# EAGLE design 6in_alarm_4te-disp (EAGLE 5.07)
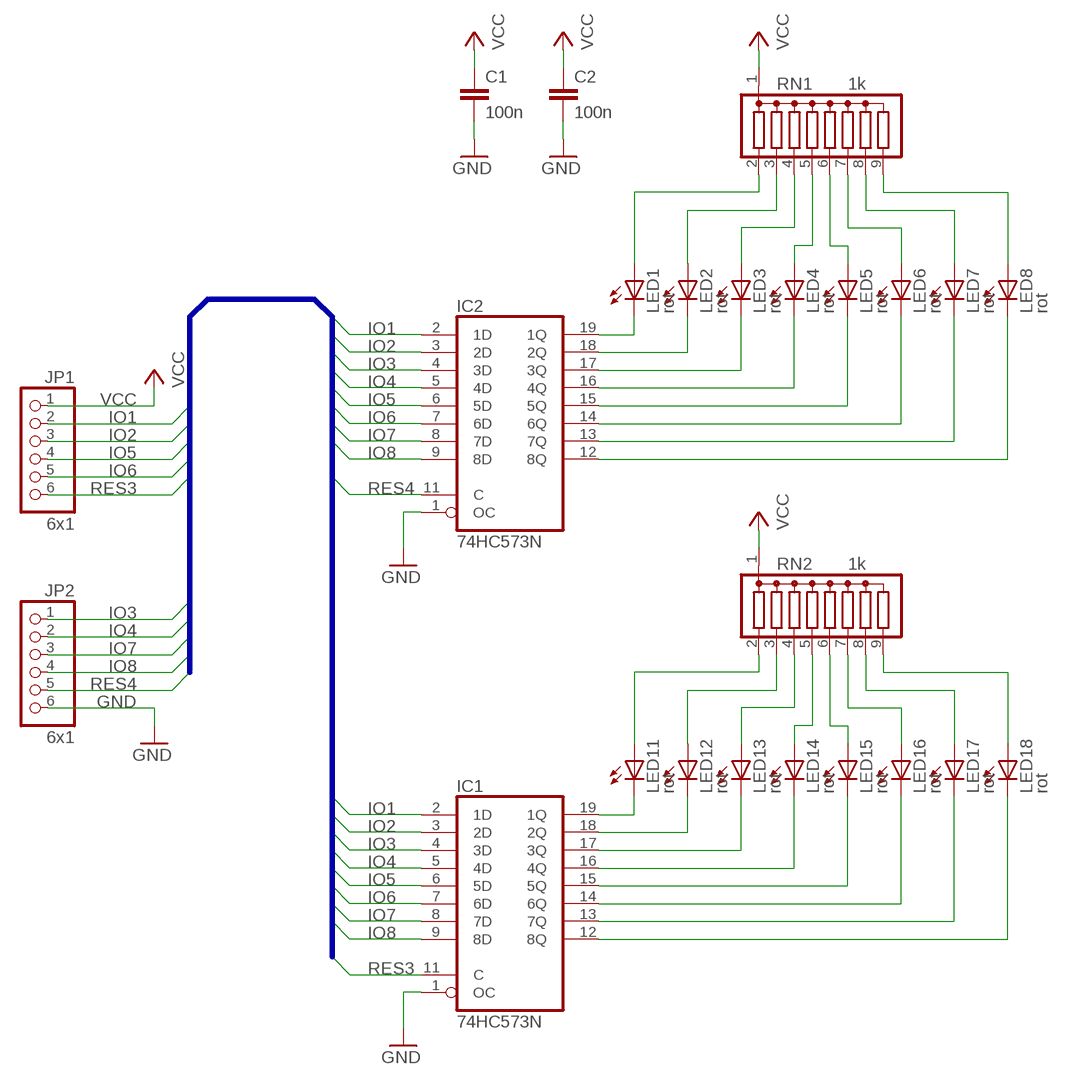
[diagram p0: schematic, sheet 1]

## Parts
C1  100n  C-EU025-024X044  [C025-024X044]
C2  100n  C-EU025-024X044  [C025-024X044]
IC1  74HC573N  [DIL20]
IC2  74HC573N  [DIL20]
JP1  6x1  PINHD-1X6  [1X06]
JP2  6x1  PINHD-1X6  [1X06]
LED1  rot  LED3MM  [LED3MM]
LED2  rot  LED3MM  [LED3MM]
LED3  rot  LED3MM  [LED3MM]
LED4  rot  LED3MM  [LED3MM]
LED5  rot  LED3MM  [LED3MM]
LED6  rot  LED3MM  [LED3MM]
LED7  rot  LED3MM  [LED3MM]
LED8  rot  LED3MM  [LED3MM]
LED11  rot  LED3MM  [LED3MM]
LED12  rot  LED3MM  [LED3MM]
LED13  rot  LED3MM  [LED3MM]
LED14  rot  LED3MM  [LED3MM]
LED15  rot  LED3MM  [LED3MM]
LED16  rot  LED3MM  [LED3MM]
LED17  rot  LED3MM  [LED3MM]
LED18  rot  LED3MM  [LED3MM]
RN1  1k  G08R  [SIL9]
RN2  1k  G08R  [SIL9]

## Nets
GND: C1.2 C2.2 IC1.1(OC) IC2.1(OC) JP2.6
IO1: IC1.2(1D) IC2.2(1D) JP1.2
IO2: IC1.3(2D) IC2.3(2D) JP1.3
IO3: IC1.4(3D) IC2.4(3D) JP2.1
IO4: IC1.5(4D) IC2.5(4D) JP2.2
IO5: IC1.6(5D) IC2.6(5D) JP1.4
IO6: IC1.7(6D) IC2.7(6D) JP1.5
IO7: IC1.8(7D) IC2.8(7D) JP2.3
IO8: IC1.9(8D) IC2.9(8D) JP2.4
N$1: IC2.19(1Q) LED1.K(C)
N$2: IC2.18(2Q) LED2.K(C)
N$3: LED1.A RN1.2
N$4: LED2.A RN1.3
N$5: LED3.A RN1.4
N$6: LED4.A RN1.5
N$7: LED5.A RN1.6
N$8: LED6.A RN1.7
N$9: LED7.A RN1.8
N$10: LED8.A RN1.9
N$11: IC2.17(3Q) LED3.K(C)
N$12: IC2.16(4Q) LED4.K(C)
N$13: IC2.15(5Q) LED5.K(C)
N$14: IC2.14(6Q) LED6.K(C)
N$15: IC2.13(7Q) LED7.K(C)
N$16: IC2.12(8Q) LED8.K(C)
N$17: IC1.19(1Q) LED11.K(C)
N$18: IC1.18(2Q) LED12.K(C)
N$19: LED11.A RN2.2
N$20: LED12.A RN2.3
N$21: LED13.A RN2.4
N$22: LED15.A RN2.6
N$23: LED14.A RN2.5
N$24: LED16.A RN2.7
N$25: LED17.A RN2.8
N$26: LED18.A RN2.9
N$27: IC1.17(3Q) LED13.K(C)
N$28: IC1.16(4Q) LED14.K(C)
N$29: IC1.15(5Q) LED15.K(C)
N$30: IC1.14(6Q) LED16.K(C)
N$31: IC1.13(7Q) LED17.K(C)
N$32: IC1.12(8Q) LED18.K(C)
RES3: IC1.11(C) JP1.6
RES4: IC2.11(C) JP2.5
VCC: C1.1 C2.1 JP1.1 RN1.1 RN2.1

## Buses
IO1,IO2,IO3,IO4,IO5,IO6,IO7,IO8,RES3,RES4

## Power pins joined to a net without a drawn wire
GND: IC1.10(GND) IC2.10(GND)
VCC: IC1.20(VCC) IC2.20(VCC)

## Library data of the parts
C1 C2 = rcl:C-EU: CAPACITOR, European symbol
IC1 IC2 = 74xx-eu:74*573: 8-bit D latch BUS DRIVER
JP1 JP2 = pinhead:PINHD-1X6: PIN HEADER
LED1-LED8 LED11-LED18 = led:LED: LED OSRAM: - CHIPLED LG R971, LG N971, LY N971, LG Q971, LY Q971, LO R971, LY R971 LH N974, LH R974 LS Q976, LO Q976, LY Q976 LO Q996 - Hyper CHIPLED LW Q18S LB Q993, LB Q99A, LB R99A - SideLED LS A670, LO A670, LY A670, LG A670, LP A670 LB A673, LV A673, LT A673, LW A673 LH A674 LY A675 LS A676, LA A676, LO A676, LY A676, LW A676 LS A679, LY A679, LG A679 - Hyper Micro SIDELED® LS Y876, LA Y876, LO Y876, LY Y876 LT Y87S - SmartLED LW L88C, LW L88S LB L89C, LB L89S, LG L890 LS L89K, LO L89K, LY L89K LS L896, LA L896, LO L896, LY L896 - TOPLED LS T670, LO T670, LY T670, LG T670, LP T670 LSG T670, LSP T670, LSY T670, LOP T670, LYG T670 LG T671, LOG T671, LSG T671 LB T673, LV T673, LT T673, LW T673 LH T674 LS T676, LA T676, LO T676, LY T676, LB T676, LH T676, LSB T676, LW T676 LB T67C, LV T67C, LT T67C, LS T67K, LO T67K, LY T67K, LW E67C LS E67B, LA E67B, LO E67B, LY E67B, LB E67C, LV E67C, LT E67C LW T67C LS T679, LY T679, LG T679 LS T770, LO T770, LY T770, LG T770, LP T770 LB T773, LV T773, LT T773, LW T773 LH T774 LS E675, LA E675, LY E675, LS T675 LS T776, LA T776, LO T776, LY T776, LB T776 LHGB T686 LT T68C, LB T68C - Hyper Mini TOPLED® LB M676 - Mini TOPLED Santana® LG M470 LS M47K, LO M47K, LY M47K Source: http://www.osram.convergy.de LUXEON: - LUMILED® LXK2-PW12-R00, LXK2-PW12-S00, LXK2-PW14-U00, LXK2-PW14-V00 LXK2-PM12-R00, LXK2-PM12-S00, LXK2-PM14-U00 LXK2-PE12-Q00, LXK2-PE12-R00, LXK2-PE12-S00, LXK2-PE14-T00, LXK2-PE14-U00 LXK2-PB12-K00, LXK2-PB12-L00, LXK2-PB12-M00, LXK2-PB14-N00, LXK2-PB14-P00, LXK2-PB14-Q00 LXK2-PR12-L00, LXK2-PR12-M00, LXK2-PR14-Q00, LXK2-PR14-R00 LXK2-PD12-Q00, LXK2-PD12-R00, LXK2-PD12-S00 LXK2-PH12-R00, LXK2-PH12-S00 LXK2-PL12-P00, LXK2-PL12-Q00, LXK2-PL12-R00 Source: www.luxeon.com KINGBRIGHT: KA-3528ASYC Source: www.kingbright.com
RN1 RN2 = resistor-sil:G08R: SIL RESISTOR

## Board
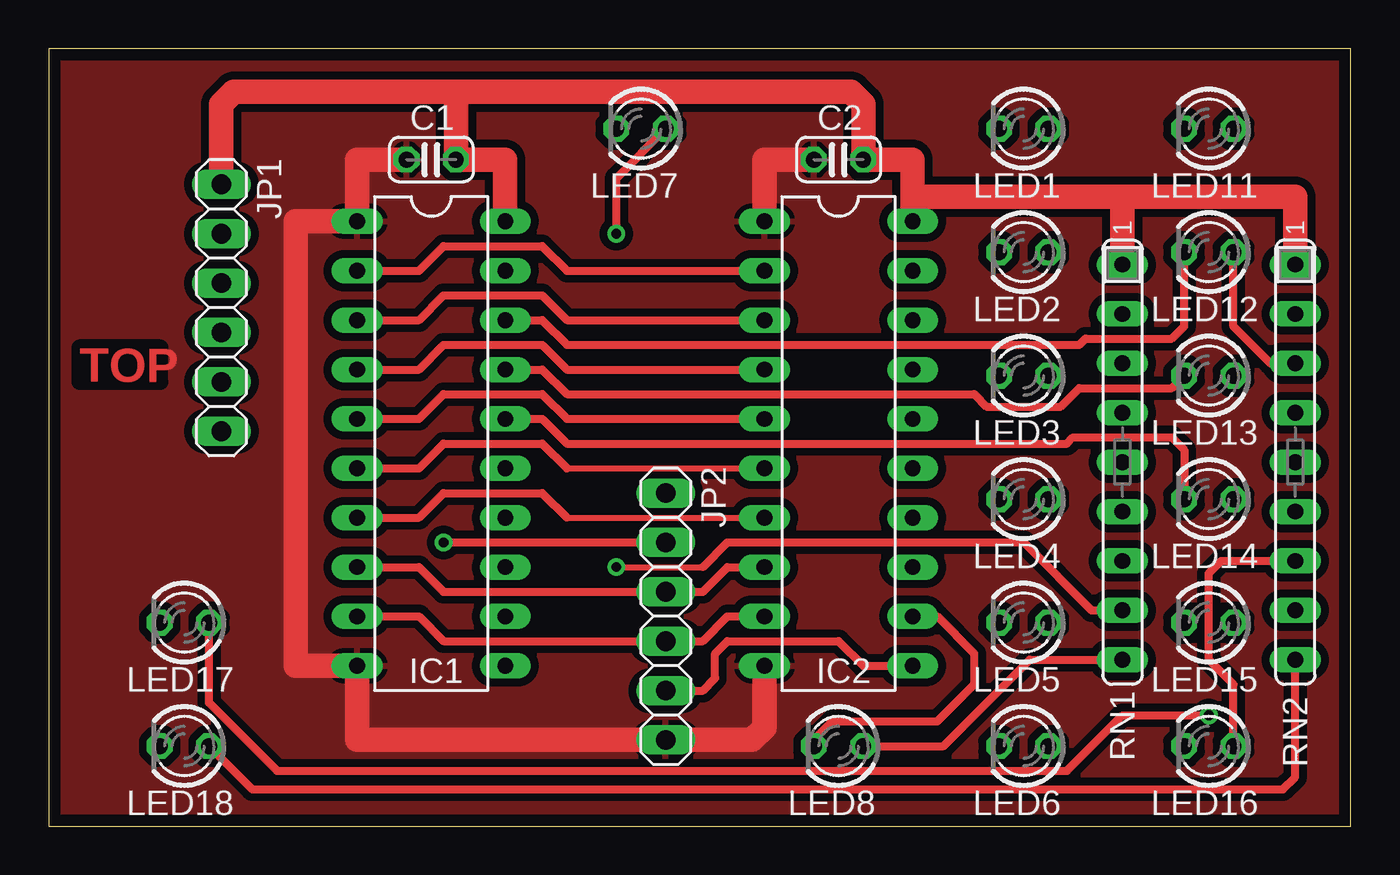
[diagram p1: board, top side]
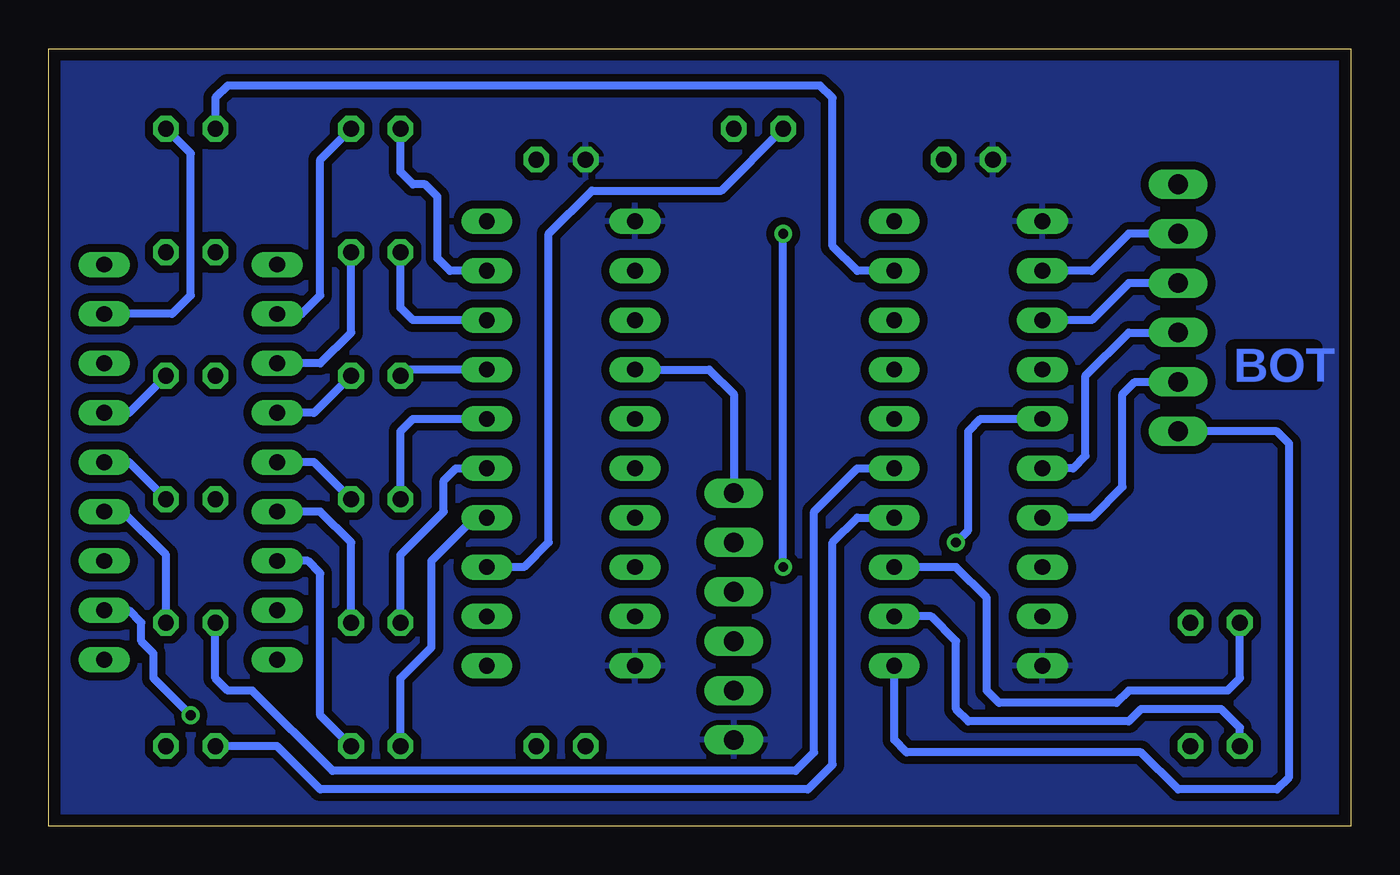
[diagram p2: board, bottom side, seen from below]

Size 67 x 40 mm. Coordinates in mm from the lower left corner, seen from the top.
Outline: 0,0 67,0 67,40 0,40 0,0
Copper layers (1*16): Top 0.035mm / dielectric 1.5mm / Bottom 0.035mm
Design rules "default *": minimum track width 10mil, minimum drill 0.5mm, track to track 16mil, track to pad 16mil, pad to pad 16mil, via to via 16mil, smd to smd 16mil, copper to edge 24mil, drill to drill 8mil, minimum pad ring 10mil, minimum via ring 8mil, stop-mask expansion 4mil, vias tented up to drill 0mil, thermal gap 10mil

### Footprints (pad centres in the part's own frame; a part is rotated, then mirrored left to right if it is on the bottom)
C025-024X044 = drill 0.813 octagon: 1 -1.27,0; 2 1.27,0
DIL20 = drill 0.813 long: 1 -11.43,-3.81; 2 -8.89,-3.81; 3 -6.35,-3.81; 4 -3.81,-3.81; 5 -1.27,-3.81; 6 1.27,-3.81; 7 3.81,-3.81; 8 6.35,-3.81; 9 8.89,-3.81; 10 11.43,-3.81; 11 11.43,3.81; 12 8.89,3.81; 13 6.35,3.81; 14 3.81,3.81; 15 1.27,3.81; 16 -1.27,3.81; 17 -3.81,3.81; 18 -6.35,3.81; 19 -8.89,3.81; 20 -11.43,3.81
1X06 = drill 1.016 long: 1 -6.35,0; 2 -3.81,0; 3 -1.27,0; 4 1.27,0; 5 3.81,0; 6 6.35,0
LED3MM = drill 0.813 octagon: A -1.27,0; K 1.27,0
SIL9 = drill 0.813 long: 1 -10.16,0; 2 -7.62,0; 3 -5.08,0; 4 -2.54,0; 5 0,0; 6 2.54,0; 7 5.08,0; 8 7.62,0; 9 10.16,0

### Placement (x,y rotation side)
C1  19.68,34.29 180 top
C2  40.64,34.29 180 top
IC1  19.68,19.68 270 top
IC2  40.64,19.68 270 top
JP1  8.89,26.67 270 top
JP2  31.75,10.79 270 top
LED1  50.16,35.88 180 top
LED2  50.16,29.53 180 top
LED3  50.16,23.18 180 top
LED4  50.16,16.83 180 top
LED5  50.16,10.48 180 top
LED6  50.16,4.13 180 top
LED7  30.48,35.88 180 top
LED8  40.64,4.13 180 top
LED11  59.69,35.88 180 top
LED12  59.69,29.53 180 top
LED13  59.69,23.18 180 top
LED14  59.69,16.83 180 top
LED15  59.69,10.48 180 top
LED16  59.69,4.13 180 top
LED17  6.99,10.48 180 top
LED18  6.99,4.13 180 top
RN1  55.24,18.73 270 top
RN2  64.14,18.73 270 top

### Tracks (layer width: path | path; a pad name or v marks a point on that pad's centre or on a via)
GND
  Top 1.27: IC2.10 36.83,5.08 36.2,4.45 JP2.6 15.88,4.45 IC1.10 12.7,8.26 12.7,31.11 IC1.1 15.88,34.29 C1.2 | IC2.1 36.83,34.29 C2.2
  pour Top: 0.2,39.8 66.8,39.8 66.8,0.2 0.2,0.2
  pour Bottom: 0.2,39.8 66.8,39.8 66.8,0.2 0.2,0.2
IO1
  Top 0.406: IC1.2 19.05,28.57 20.32,29.84 25.4,29.84 26.67,28.57 IC2.2
  Bottom 0.406: JP1.2 11.43,30.48 13.34,28.57 IC1.2
IO2
  Top 0.406: IC1.3 19.05,26.04 20.32,27.3 25.4,27.3 26.67,26.04 IC2.3
  Bottom 0.406: JP1.3 11.43,27.94 13.34,26.04 IC1.3
IO3
  Top 0.406: IC1.4 19.05,23.5 20.32,24.77 25.4,24.77 26.67,23.5 IC2.4
  Bottom 0.406: JP2.1 31.75,22.23 33.02,23.5 IC2.4
IO4  (via drill 0.5)
  Top 0.406: IC1.5 19.05,20.95 20.32,22.23 25.4,22.23 26.67,20.95 IC2.5 | v20.32,14.61 JP2.2
  Bottom 0.406: v20.32,14.61 19.68,15.24 19.68,20.32 19.05,20.95 IC1.5
IO5
  Top 0.305: 26.67,18.41 IC2.6
  Top 0.406: IC1.6 19.05,18.41 20.32,19.68 25.4,19.68 26.67,18.41
  Bottom 0.406: JP1.4 11.43,25.4 13.65,23.18 13.65,19.05 14.29,18.41 IC1.6
IO6
  Top 0.305: 26.67,15.88 IC2.7
  Top 0.406: IC1.7 19.05,15.88 20.32,17.14 25.4,17.14 26.67,15.88
  Bottom 0.406: JP1.5 11.11,22.86 11.75,22.23 11.75,17.46 13.34,15.88 IC1.7
IO7
  Top 0.406: IC2.8 34.92,13.34 33.66,12.06 32.38,12.06 JP2.3 20.32,12.06 19.05,13.34 IC1.8
IO8
  Top 0.406: IC1.9 19.05,10.79 20.32,9.53 JP2.4 33.66,9.53 34.92,10.79 IC2.9
N$1
  Bottom 0.406: IC2.19 46.35,28.57 46.99,29.21 46.99,32.38 47.62,33.02 48.26,33.02 48.9,33.66 LED1.K
N$2
  Bottom 0.406: IC2.18 48.26,26.04 48.9,26.67 LED2.K
N$3
  Bottom 0.406: RN1.2 53.98,26.35 53.02,27.3 53.02,34.29 LED1.A
N$4
  Bottom 0.406: RN1.3 53.02,23.81 51.44,25.4 LED2.A
N$5
  Bottom 0.406: RN1.4 53.34,21.27 LED3.A
N$6
  Bottom 0.406: RN1.5 53.34,18.73 LED4.A
N$7
  Bottom 0.406: RN1.6 53.02,16.19 51.44,14.61 LED5.A
N$8
  Bottom 0.406: RN1.7 53.66,13.65 53.02,13.02 53.02,5.71 LED6.A
N$9  (via drill 0.5)
  Top 0.305: v29.21,13.34 33.66,13.34
  Top 0.406: RN1.8 53.66,11.11 50.16,14.61 34.92,14.61 33.66,13.34 | v29.21,30.48 29.21,33.34 LED7.A
  Bottom 0.406: v29.21,13.34 v29.21,30.48
N$10
  Top 0.406: RN1.9 50.48,8.57 46.04,4.13 LED8.A
N$11
  Bottom 0.406: IC2.17 48.58,23.5 LED3.K
N$12
  Bottom 0.406: IC2.16 48.26,20.95 48.9,20.32 LED4.K
N$13
  Bottom 0.406: IC2.15 46.04,18.41 46.67,17.78 46.67,16.19 48.9,13.97 LED5.K
N$14
  Bottom 0.406: LED6.K 48.9,7.62 47.31,9.21 47.31,13.65 45.09,15.88 IC2.14
N$15
  Bottom 0.406: IC2.13 42.55,13.34 41.27,14.61 41.27,30.48 39.05,32.7 32.38,32.7 LED7.K
N$16
  Top 0.406: LED8.K 39.37,4.45 40.32,5.4 45.72,5.4 47.62,7.3 47.62,8.89 45.72,10.79 IC2.12
N$17
  Bottom 0.406: IC1.19 25.4,28.57 26.67,29.84 26.67,37.47 27.3,38.1 57.78,38.1 58.42,37.47 LED11.K
N$18
  Top 0.406: IC1.18 25.4,26.04 26.67,24.77 53.02,24.77 53.34,25.08 57.78,25.08 58.42,25.72 LED12.K
N$19
  Bottom 0.406: RN2.2 60.64,26.35 59.69,27.3 59.69,34.61 LED11.A
N$20
  Top 0.406: LED12.A 60.96,25.72 62.87,23.81 RN2.3
N$21
  Bottom 0.406: RN2.4 62.87,21.27 LED13.A
N$22
  Bottom 0.406: RN2.6 63.18,16.19 60.96,13.97 LED15.A
N$23
  Bottom 0.406: RN2.5 62.87,18.73 LED14.A
N$24
  Top 0.406: RN2.7 60.33,13.65 59.69,13.02 59.69,8.57 60.96,7.3 LED16.A
N$25  (via drill 0.5)
  Top 0.406: LED17.A 8.26,6.35 11.75,2.86 52.39,2.86 55.24,5.71 v59.69,5.71
  Bottom 0.406: RN2.8 62.87,11.11 62.23,10.48 62.23,9.53 61.59,8.89 61.59,7.62 v59.69,5.71
N$26
  Top 0.406: RN2.9 64.14,2.54 63.5,1.91 10.48,1.91 LED18.A
N$27
  Top 0.406: IC1.17 25.4,23.5 26.67,22.23 47.62,22.23 48.26,21.59 52.07,21.59 53.02,22.54 57.78,22.54 LED13.K
N$28
  Top 0.406: IC1.16 25.4,20.95 26.67,19.68 52.39,19.68 52.7,20 57.78,20 58.42,19.37 LED14.K
N$29
  Bottom 0.406: IC1.15 25.4,18.41 27.62,16.19 27.62,3.81 28.57,2.86 52.39,2.86 56.52,6.99 57.78,6.99 58.42,7.62 LED15.K
N$30
  Bottom 0.406: IC1.14 25.4,15.88 26.67,14.61 26.67,3.17 27.94,1.91 53.02,1.91 55.24,4.13 LED16.K
N$31
  Bottom 0.406: IC1.13 20.32,13.34 18.73,11.75 18.73,6.99 18.1,6.35 12.06,6.35 11.43,6.99 6.35,6.99 5.71,7.62 LED17.K
N$32
  Bottom 0.406: IC1.12 21.59,10.79 20.32,9.53 20.32,6.03 19.68,5.4 11.43,5.4 10.79,6.03 6.67,6.03 5.71,5.08 LED18.K
RES3
  Bottom 0.406: IC1.11 23.5,4.45 22.86,3.81 10.79,3.81 8.89,1.91 3.81,1.91 3.17,2.54 3.17,19.68 3.81,20.32 JP1.6
RES4
  Top 0.406: JP2.5 33.66,6.99 34.29,7.62 34.29,8.89 34.92,9.53 40.64,9.53 41.91,8.26 IC2.11
VCC
  Top 1.27: 44.45,32.38 IC2.20 | 20.95,37.78 9.53,37.78 8.89,37.15 JP1.1 | 20.95,37.78 41.27,37.78 41.91,37.15 C2.1 44.45,34.29 44.45,32.38 | 20.95,37.78 C1.1 23.5,34.29 IC1.20 | 55.24,32.38 RN1.1 | 44.45,32.38 55.24,32.38 | RN2.1 64.14,32.38 55.24,32.38

### Text on the board
Top: TOP
Bottom: BOT